# Altium schematic sheet PowerBoard.SchDoc
size A4; SheetNumber: 1; SheetTotal: 1
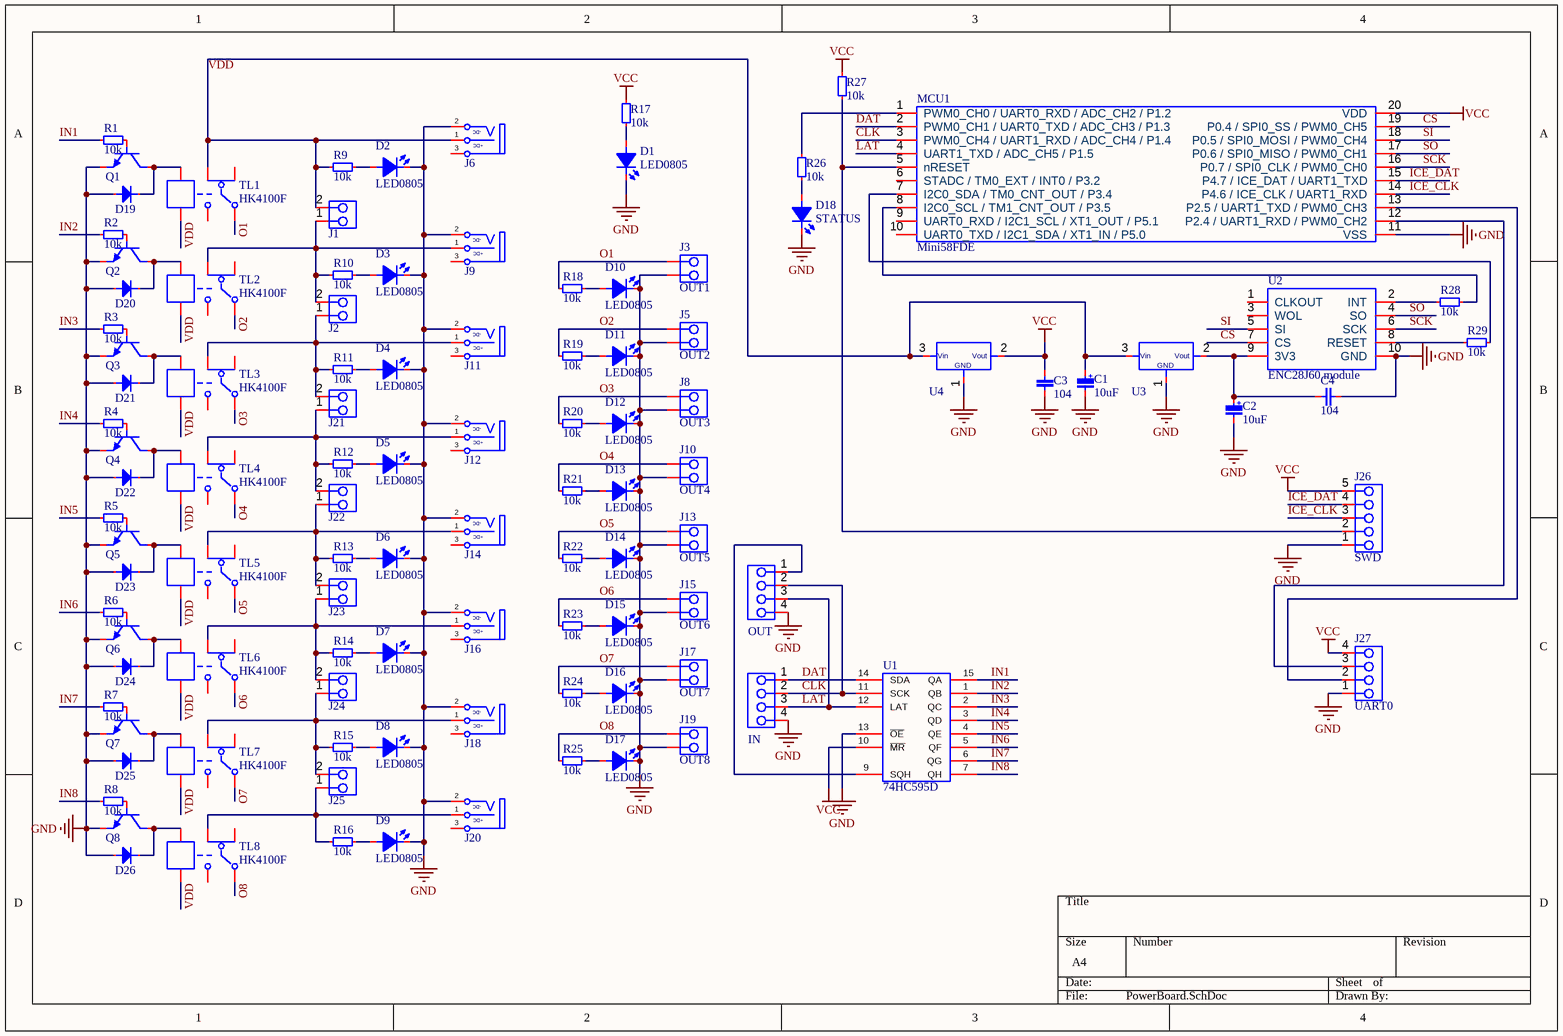
[diagram p0: PowerBoard.SchDoc]

## Parts
C1  10uF  [CAP_RAD_D05x11]
C2  10uF  [CAP_RAD_D05x11]
C3  104  [C0805]
C4  104  [C0805]
D1  LED0805  [L0805RED]
D2  LED0805  [L0805RED]
D3  LED0805  [L0805RED]
D4  LED0805  [L0805RED]
D5  LED0805  [L0805RED]
D6  LED0805  [L0805RED]
D7  LED0805  [L0805RED]
D8  LED0805  [L0805RED]
D9  LED0805  [L0805RED]
D10  LED0805  [L0805RED]
D11  LED0805  [L0805RED]
D12  LED0805  [L0805RED]
D13  LED0805  [L0805RED]
D14  LED0805  [L0805RED]
D15  LED0805  [L0805RED]
D16  LED0805  [L0805RED]
D17  LED0805  [L0805RED]
D18  STATUS  [L0805RED]
D19  1N4148  [SOD-80]  (value not drawn)
D20  1N4148  [SOD-80]  (value not drawn)
D21  1N4148  [SOD-80]  (value not drawn)
D22  1N4148  [SOD-80]  (value not drawn)
D23  1N4148  [SOD-80]  (value not drawn)
D24  1N4148  [SOD-80]  (value not drawn)
D25  1N4148  [SOD-80]  (value not drawn)
D26  1N4148  [SOD-80]  (value not drawn)
J1  HEADER-MALE-2.54MM  [HEADER-MALE-02PINS-2.54MM]  (value not drawn)
J2  HEADER-MALE-2.54MM  [HEADER-MALE-02PINS-2.54MM]  (value not drawn)
J3  OUT1  [DG306-5.0-02P-12-00AH]
J4  OUT  [JST - XH - Thru (R) - 4Pin - 2.54mm]
J5  OUT2  [DG306-5.0-02P-12-00AH]
J6  IN1  [DC_K375A_Power]  (value not drawn)
J7  IN  [JST - XH - Thru (R) - 4Pin - 2.54mm]
J8  OUT3  [DG306-5.0-02P-12-00AH]
J9  IN2  [DC_K375A_Power]  (value not drawn)
J10  OUT4  [DG306-5.0-02P-12-00AH]
J11  IN3  [DC_K375A_Power]  (value not drawn)
J12  IN4  [DC_K375A_Power]  (value not drawn)
J13  OUT5  [DG306-5.0-02P-12-00AH]
J14  IN5  [DC_K375A_Power]  (value not drawn)
J15  OUT6  [DG306-5.0-02P-12-00AH]
J16  IN6  [DC_K375A_Power]  (value not drawn)
J17  OUT7  [DG306-5.0-02P-12-00AH]
J18  IN7  [DC_K375A_Power]  (value not drawn)
J19  OUT8  [DG306-5.0-02P-12-00AH]
J20  IN8  [DC_K375A_Power]  (value not drawn)
J21  HEADER-MALE-2.54MM  [HEADER-MALE-02PINS-2.54MM]  (value not drawn)
J22  HEADER-MALE-2.54MM  [HEADER-MALE-02PINS-2.54MM]  (value not drawn)
J23  HEADER-MALE-2.54MM  [HEADER-MALE-02PINS-2.54MM]  (value not drawn)
J24  HEADER-MALE-2.54MM  [HEADER-MALE-02PINS-2.54MM]  (value not drawn)
J25  HEADER-MALE-2.54MM  [HEADER-MALE-02PINS-2.54MM]  (value not drawn)
J26  SWD  [HEADER-MALE-05PINS-2.54MM]
J27  UART0  [HEADER-MALE-04PINS-2.54MM]
MCU1  Mini58FDE  [TSSOP20_0.65_4.4]
Q1  2N3904  [SOT23-3]  (value not drawn)
Q2  2N3904  [SOT23-3]  (value not drawn)
Q3  2N3904  [SOT23-3]  (value not drawn)
Q4  2N3904  [SOT23-3]  (value not drawn)
Q5  2N3904  [SOT23-3]  (value not drawn)
Q6  2N3904  [SOT23-3]  (value not drawn)
Q7  2N3904  [SOT23-3]  (value not drawn)
Q8  2N3904  [SOT23-3]  (value not drawn)
R1  10k  [R0805]
R2  10k  [R0805]
R3  10k  [R0805]
R4  10k  [R0805]
R5  10k  [R0805]
R6  10k  [R0805]
R7  10k  [R0805]
R8  10k  [R0805]
R9  10k  [R0805]
R10  10k  [R0805]
R11  10k  [R0805]
R12  10k  [R0805]
R13  10k  [R0805]
R14  10k  [R0805]
R15  10k  [R0805]
R16  10k  [R0805]
R17  10k  [R0805]
R18  10k  [R0805]
R19  10k  [R0805]
R20  10k  [R0805]
R21  10k  [R0805]
R22  10k  [R0805]
R23  10k  [R0805]
R24  10k  [R0805]
R25  10k  [R0805]
R26  10k  [R0805]
R27  10k  [R0805]
R28  10k  [R0805]
R29  10k  [R0805]
TL1  HK4100F  [RELAY-HK4100F-DC3V-SHG]
TL2  HK4100F  [RELAY-HK4100F-DC3V-SHG]
TL3  HK4100F  [RELAY-HK4100F-DC3V-SHG]
TL4  HK4100F  [RELAY-HK4100F-DC3V-SHG]
TL5  HK4100F  [RELAY-HK4100F-DC3V-SHG]
TL6  HK4100F  [RELAY-HK4100F-DC3V-SHG]
TL7  HK4100F  [RELAY-HK4100F-DC3V-SHG]
TL8  HK4100F  [RELAY-HK4100F-DC3V-SHG]
U1  74HC595D  [SO16]
U2  ENC28J60 module  [ENC28J60]
U3  AMS1117  [SOT223-3]  (value not drawn)
U4  AMS1117  [SOT223-3]  (value not drawn)

## Nets
GND: C1.2 C2.2 C3.1 C4.1 D1.2(K) D2.2(K) D3.2(K) D4.2(K) D5.2(K) D6.2(K) D7.2(K) D8.2(K) D9.2(K) D10.2(K) D11.2(K) D12.2(K) D13.2(K) D14.2(K) D15.2(K) D16.2(K) D17.2(K) D18.2(K) D19.1 D20.1 D21.1 D22.1 D23.1 D24.1 D25.1 D26.1 J3.1 J4.4 J5.1 J6.2(DC-) J7.4 J8.1 J9.2(DC-) J10.1 J11.2(DC-) J12.2(DC-) J13.1 J14.2(DC-) J15.1 J16.2(DC-) J17.1 J18.2(DC-) J19.1 J20.2(DC-) J26.1 J27.1 MCU1.11(VSS) Q1.2(E) Q2.2(E) Q3.2(E) Q4.2(E) Q5.2(E) Q6.2(E) Q7.2(E) Q8.2(E) U1.8 U1.13(~{OE}) U2.10(GND) U3.1 U4.1
VCC: C3.2 J26.5 J27.4 MCU1.20(VDD) R17.1 R27.1 U1.10(~{MR}) U1.16 U4.2
CLK: J4.2 J7.2 MCU1.3(PWM0_CH4_/_UART1_RXD_/_ADC_CH4_/_P1.4) U1.11(SCK)
CS: MCU1.19(P0.4_/_SPI0_SS_/_PWM0_CH5) U2.7(CS)
DAT: J7.1 MCU1.2(PWM0_CH1_/_UART0_TXD_/_ADC_CH3_/_P1.3) U1.14(SDA)
ICE_CLK: J26.3 MCU1.14(P4.6_/_ICE_CLK_/_UART1_RXD)
ICE_DAT: J26.4 MCU1.15(P4.7_/_ICE_DAT_/_UART1_TXD)
IN1: R1.1 U1.15(QA)
IN2: R2.1 U1.1(QB)
IN3: R3.1 U1.2(QC)
IN4: R4.1 U1.3(QD)
IN5: R5.1 U1.4(QE)
IN6: R6.1 U1.5(QF)
IN7: R7.1 U1.6(QG)
IN8: R8.1 U1.7(QH)
LAT: J4.3 J7.3 MCU1.4(UART1_TXD_/_ADC_CH5_/_P1.5) U1.12(LAT)
O1: J3.2 R18.1 TL1.4
O2: J5.2 R19.1 TL2.4
O3: J8.2 R20.1 TL3.4
O4: J10.2 R21.1 TL4.4
O5: J13.2 R22.1 TL5.4
O6: J15.2 R23.1 TL6.4
O7: J17.2 R24.1 TL7.4
O8: J19.2 R25.1 TL8.4
SCK: MCU1.16(P0.7_/_SPI0_CLK_/_PWM0_CH0) U2.6(SCK)
SI: MCU1.18(P0.5_/_SPI0_MOSI_/_PWM0_CH4) U2.5(SI)
SO: MCU1.17(P0.6_/_SPI0_MISO_/_PWM0_CH1) U2.4(SO)
VDD: C1.1 J1.2 J6.1(DS+) R9.1 TL1.5 TL1.6 TL2.5 TL3.5 TL4.5 TL5.5 TL6.5 TL7.5 TL8.5 U3.3 U4.3
NetC2_1: C2.1 C4.2 U2.9(3V3) U3.2
NetD1_1: D1.1(A) R17.2
NetD2_1: D2.1(A) R9.2
NetD3_1: D3.1(A) R10.2
NetD4_1: D4.1(A) R11.2
NetD5_1: D5.1(A) R12.2
NetD6_1: D6.1(A) R13.2
NetD7_1: D7.1(A) R14.2
NetD8_1: D8.1(A) R15.2
NetD9_1: D9.1(A) R16.2
NetD10_1: D10.1(A) R18.2
NetD11_1: D11.1(A) R19.2
NetD12_1: D12.1(A) R20.2
NetD13_1: D13.1(A) R21.2
NetD14_1: D14.1(A) R22.2
NetD15_1: D15.1(A) R23.2
NetD16_1: D16.1(A) R24.2
NetD17_1: D17.1(A) R25.2
NetD18_1: D18.1(A) R26.2
NetD19_2: D19.2 Q1.3(C) TL1.2
NetD20_2: D20.2 Q2.3(C) TL2.2
NetD21_2: D21.2 Q3.3(C) TL3.2
NetD22_2: D22.2 Q4.3(C) TL4.2
NetD23_2: D23.2 Q5.3(C) TL5.2
NetD24_2: D24.2 Q6.3(C) TL6.2
NetD25_2: D25.2 Q7.3(C) TL7.2
NetD26_2: D26.2 Q8.3(C) TL8.2
NetJ1_1: J1.1 J2.2 J9.1(DS+) R10.1 TL2.6
NetJ2_1: J2.1 J11.1(DS+) J21.2 R11.1 TL3.6
NetJ4_1: J4.1 U1.9(SQH)
NetJ12_1: J12.1(DS+) J21.1 J22.2 R12.1 TL4.6
NetJ14_1: J14.1(DS+) J22.1 J23.2 R13.1 TL5.6
NetJ16_1: J16.1(DS+) J23.1 J24.2 R14.1 TL6.6
NetJ18_1: J18.1(DS+) J24.1 J25.2 R15.1 TL7.6
NetJ20_1: J20.1(DS+) J25.1 R16.1 TL8.6
NetJ26_2: J26.2 MCU1.5(nRESET) R27.2
NetJ27_2: J27.2 MCU1.13(P2.5_/_UART1_TXD_/_PWM0_CH3)
NetJ27_3: J27.3 MCU1.12(P2.4_/_UART1_RXD_/_PWM0_CH2)
NetMCU1_1: MCU1.1(PWM0_CH0_/_UART0_RXD_/_ADC_CH2_/_P1.2) R26.1
NetMCU1_7: MCU1.7(I2C0_SDA_/_TM0_CNT_OUT_/_P3.4) R29.2
NetMCU1_8: MCU1.8(I2C0_SCL_/_TM1_CNT_OUT_/_P3.5) R28.2
NetQ1_1: Q1.1(B) R1.2
NetQ2_1: Q2.1(B) R2.2
NetQ3_1: Q3.1(B) R3.2
NetQ4_1: Q4.1(B) R4.2
NetQ5_1: Q5.1(B) R5.2
NetQ6_1: Q6.1(B) R6.2
NetQ7_1: Q7.1(B) R7.2
NetQ8_1: Q8.1(B) R8.2
NetR28_1: R28.1 U2.2(INT)
NetR29_1: R29.1 U2.8(RESET)

Not connected (* = marked no-connect by the designer): J6 3(T); J9 3(T); J11 3(T); J12 3(T); J14 3(T); J16 3(T); J18 3(T); J20 3(T); MCU1 6(STADC_/_TM0_EXT_/_INT0_/_P3.2) 9(UART0_RXD_/_I2C1_SCL_/_XT1_OUT_/_P5.1) 10(UART0_TXD_/_I2C1_SDA_/_XT1_IN_/_P5.0); TL1 1 3; TL2 1 3; TL3 1 3; TL4 1 3; TL5 1 3; TL6 1 3; TL7 1 3; TL8 1 3; U2 1(CLKOUT) 3(WOL)

## Notes on the sheet
- (in symbol Capacitor(Radian)) +
- (in symbol Ic-AMS1117(SOT-223)) Vin; Vout; GND
- (in symbol JackDC) -DC; +DC

## Library data of the parts
C1 C2 = Capacitor(Radian)
C3 C4 = Capacitors(SMD)
D18 = LED0805
D19-D26 = Diode-1N4148: The fast switching diode
J1 J2 J21-J25 = HEADER-MALE-02PINS-2.54MM
J3 J5 J8 J10 J13 J15 J17 J19 = DG306-5.0-02P-12-00AH
J4 J7 = JST - XH - Thru (R) - 4Pin - 2.54mm
J6 J9 J11 J12 J14 J16 J18 J20 = JackDC
J26 = HEADER-MALE-05PINS-2.54MM
J27 = HEADER-MALE-04PINS-2.54MM
MCU1 = Mcu-Mini58FDE: Novoton 4Kb-RAM 32Kb-Flash
Q1-Q8 = Transistor-2N3904 (SOT-23)
R1-R29 = Resistors-SMD
TL1-TL8 = Relay-HK4100F-DC3V-SHG
U1 = Ic-74HC595D
U2 = ENC28J60
U3 U4 = Ic-AMS1117(SOT-223)